# EAGLE schematic OSSM-M5-Remote-PCB-V2 (EAGLE 9.7.0)
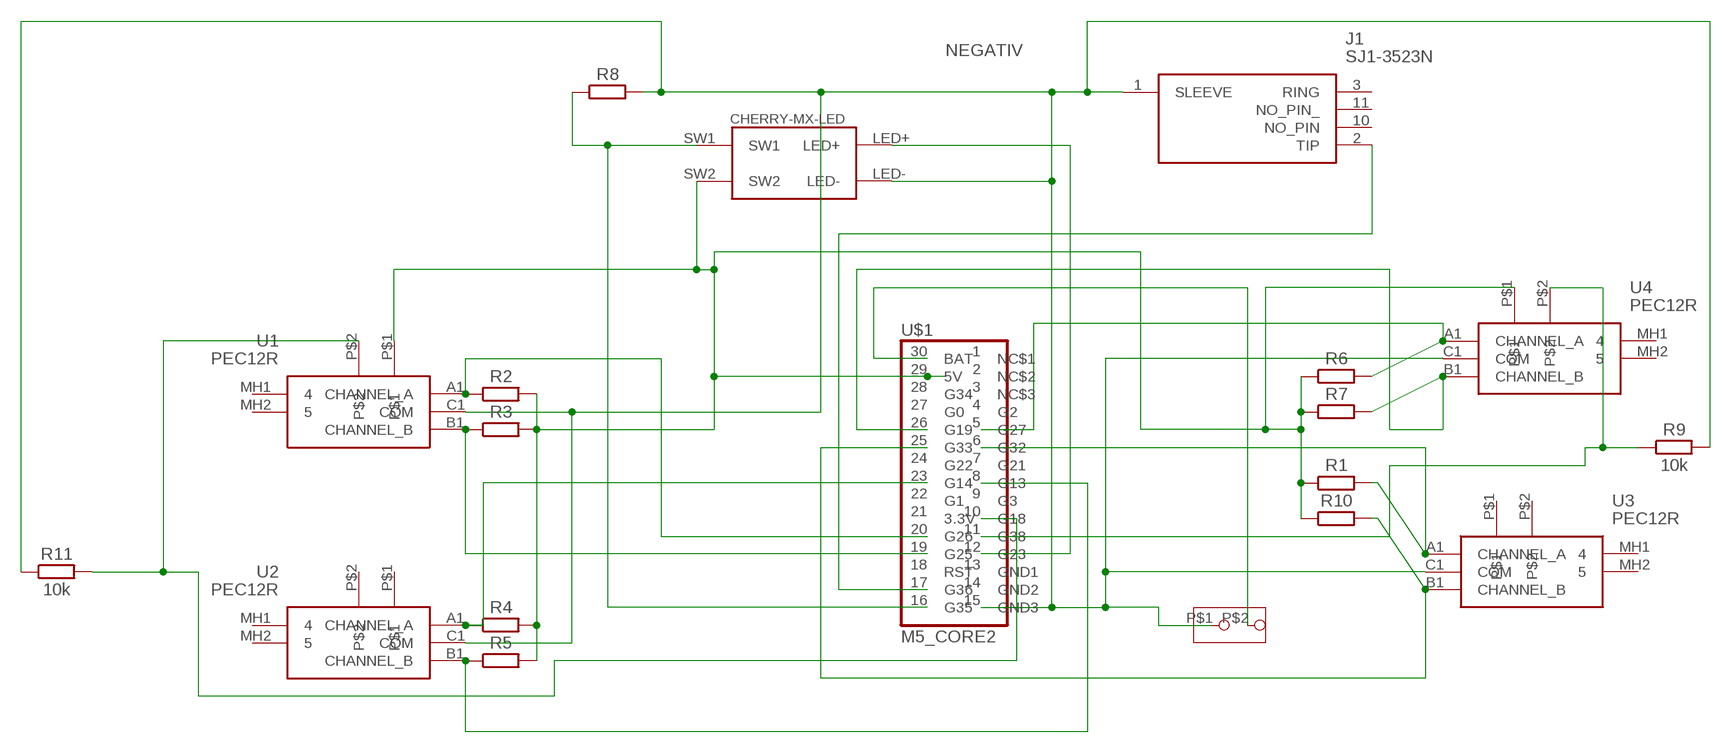
[diagram p0: schematic, sheet 1]

## Parts
J1  SJ1-3523N  [SJ13523N]
R1  R_AXIAL-7.2MM-PITCH  [RESAD724W46L381D178B]
R2  R_AXIAL-7.2MM-PITCH  [RESAD724W46L381D178B]
R3  R_AXIAL-7.2MM-PITCH  [RESAD724W46L381D178B]
R4  R_AXIAL-7.2MM-PITCH  [RESAD724W46L381D178B]
R5  R_AXIAL-7.2MM-PITCH  [RESAD724W46L381D178B]
R6  R_AXIAL-7.2MM-PITCH  [RESAD724W46L381D178B]
R7  R_AXIAL-7.2MM-PITCH  [RESAD724W46L381D178B]
R8  R_AXIAL-7.2MM-PITCH  [RESAD724W46L381D178B]
R9  10k  R_AXIAL-7.2MM-PITCH  [RESAD724W46L381D178B]
R10  R_AXIAL-7.2MM-PITCH  [RESAD724W46L381D178B]
R11  10k  R_AXIAL-7.2MM-PITCH  [RESAD724W46L381D178B]
U1  PEC12R  PEC12R-4230F-N0024  [PEC12R4017FN0024]
U2  PEC12R  PEC12R-4230F-N0024  [PEC12R4017FN0024]
U3  PEC12R  PEC12R-4230F-N0024  [PEC12R4017FN0024]
U4  PEC12R  PEC12R-4230F-N0024  [PEC12R4017FN0024]
U$1  M5_CORE2  [M5_CORE2]
U$3  JST-PH-2MM,180  [JST-PH-2.0MM_180DEGREES]
U$4  CHERRY-MX-LED  [CHERRY-MX-LED]

## Nets
+5V [Power]: R1.1 R2.2 R3.2 R4.2 R5.2 R6.1 R7.1 R10.1 U1.P$1 U4.P$1 U$1.29(5V) U$4.SW2
N$2: J1.2(TIP) U$1.17(G36)
N$3: U$1.12(G23) U$4.LED+
N$5: R2.1 U1.A1(CHANNEL_A) U$1.20(G26)
N$6: R3.1 U1.B1(CHANNEL_B) U$1.19(G25)
N$8: R4.1 U2.A1(CHANNEL_A) U$1.23(G14)
N$9 [Power]: U$1.30(BAT) U$3.P$2
N$10: R5.1 U2.B1(CHANNEL_B) U$1.8(G13)
N$11: R6.2 U4.A1(CHANNEL_A) U$1.5(G27)
N$12: R7.2 U4.B1(CHANNEL_B) U$1.26(G19)
N$13: R1.2 U3.A1(CHANNEL_A) U$1.6(G32)
N$14: R10.2 U3.B1(CHANNEL_B) U$1.25(G33)
N$26: R11.2 U1.P$2 U$1.10(G18)
N$27: R9.1 U4.P$2 U$1.11(G38)
N$31: R8.1 U$1.16(G35) U$4.SW1
NEGATIV [Power]: J1.1(SLEEVE) R8.2 R9.2 R11.1 U1.C1(COM) U2.C1(COM) U3.C1(COM) U4.C1(COM) U$1.15(GND3) U$3.P$1 U$4.LED-
Unconnected: J1.3(RING) J1.10(NO_PIN) J1.11(NO_PIN_) U1.MH1 U1.MH2 U2.MH1 U2.MH2 U2.P$1 U2.P$2 U3.MH1 U3.MH2 U3.P$1 U3.P$2 U4.MH1 U4.MH2 U$1.1(NC$1) U$1.2(NC$2) U$1.3(NC$3) U$1.4(G2) U$1.7(G21) U$1.9(G3) U$1.13(GND1) U$1.14(GND2) U$1.18(RST) U$1.21(3.3V) U$1.22(G1) U$1.24(G22) U$1.27(G0) U$1.28(G34)

## Library data of the parts
J1 = SJ1-3523N:SJ1-3523N: Phone Connectors 3.5 MM AUDIO JACK Source: Datasheet <https://componentsearchengine.com/Datasheets/1/SJ1-3523N.pdf>; DESCRIPTION: Phone Connectors 3.5 MM AUDIO JACK; HEIGHT: 5.5mm; MANUFACTURER_NAME: CUI Inc.; MANUFACTURER_PART_NUMBER: SJ1-3523N; MOUSER_PART_NUMBER: 490-SJ1-3523N; MOUSER_PRICE-STOCK: https://www.mouser.co.uk/ProductDetail/CUI-Devices/SJ1-3523N?qs=WyjlAZoYn50aNl0vAhb3Tg%3D%3D
R1-R11 = Resistor:R: Resistor Fixed - Generic; CATEGORY: Resistor; SUB-CATEGORY: Fixed
U1 = PEC12R-4230F-N0024:PEC12R-4230F-N0024: Encoders HORZ 24DET 24PULSE 30mm SHAFT W/O SW Source: Datasheet <https://www.bourns.com/docs/Product-Datasheets/PEC12R.pdf>; ARROW_PRICE-STOCK: https://www.arrow.com/en/products/pec12r-4230f-n0024/bourns; HEIGHT: 17.5mm; MANUFACTURER_NAME: Bourns; MOUSER_PRICE-STOCK: https://www.mouser.co.uk/ProductDetail/Bourns/PEC12R-4230F-N0024?qs=Zq5ylnUbLm5pfnEk8CuZjg%3D%3D
U2-U4 = PEC12R-4230F-N0024:PEC12R-4230F-N0024: Encoders HORZ 24DET 24PULSE 30mm SHAFT W/O SW Source: Datasheet <https://www.bourns.com/docs/Product-Datasheets/PEC12R.pdf>; ARROW_PART_NUMBER: PEC12R-4230F-N0024; ARROW_PRICE-STOCK: https://www.arrow.com/en/products/pec12r-4230f-n0024/bourns; DESCRIPTION: Encoders HORZ 24DET 24PULSE 30mm SHAFT W/O SW; HEIGHT: 17.5mm; MANUFACTURER_NAME: Bourns; MANUFACTURER_PART_NUMBER: PEC12R-4230F-N0024; MOUSER_PART_NUMBER: 652-PEC12R-4230F-N24; MOUSER_PRICE-STOCK: https://www.mouser.co.uk/ProductDetail/Bourns/PEC12R-4230F-N0024?qs=Zq5ylnUbLm5pfnEk8CuZjg%3D%3D
U$1 = M5-Core:M5_CORE2
U$3 = Vampix_Bauteile:JST-PH-2MM,180
U$4 = cherrymx:CHERRY-MX-LED: Cherry MX series keyswitch with LED

## Net classes
0 default: width 0.2 mm, drill 0.3 mm, clearance 0.2 mm
1 Power: width 0.4 mm, drill 0.6 mm, clearance 0.2 mm